# Altium project ADH_XC7Z010_SoC.PrjPcb (part 3 of 10)

## Sheet Zynq_Power.SchDoc: Zynq Power
size A3; DrawnBy: Emre Can Damyanlı; Revision: A.1; SheetNumber: 3; SheetTotal: 4; ENG_APP_DATE: --/--/--; DSN_APP_DATE: --/--/--; CHK_APP_DATE: --/--/--
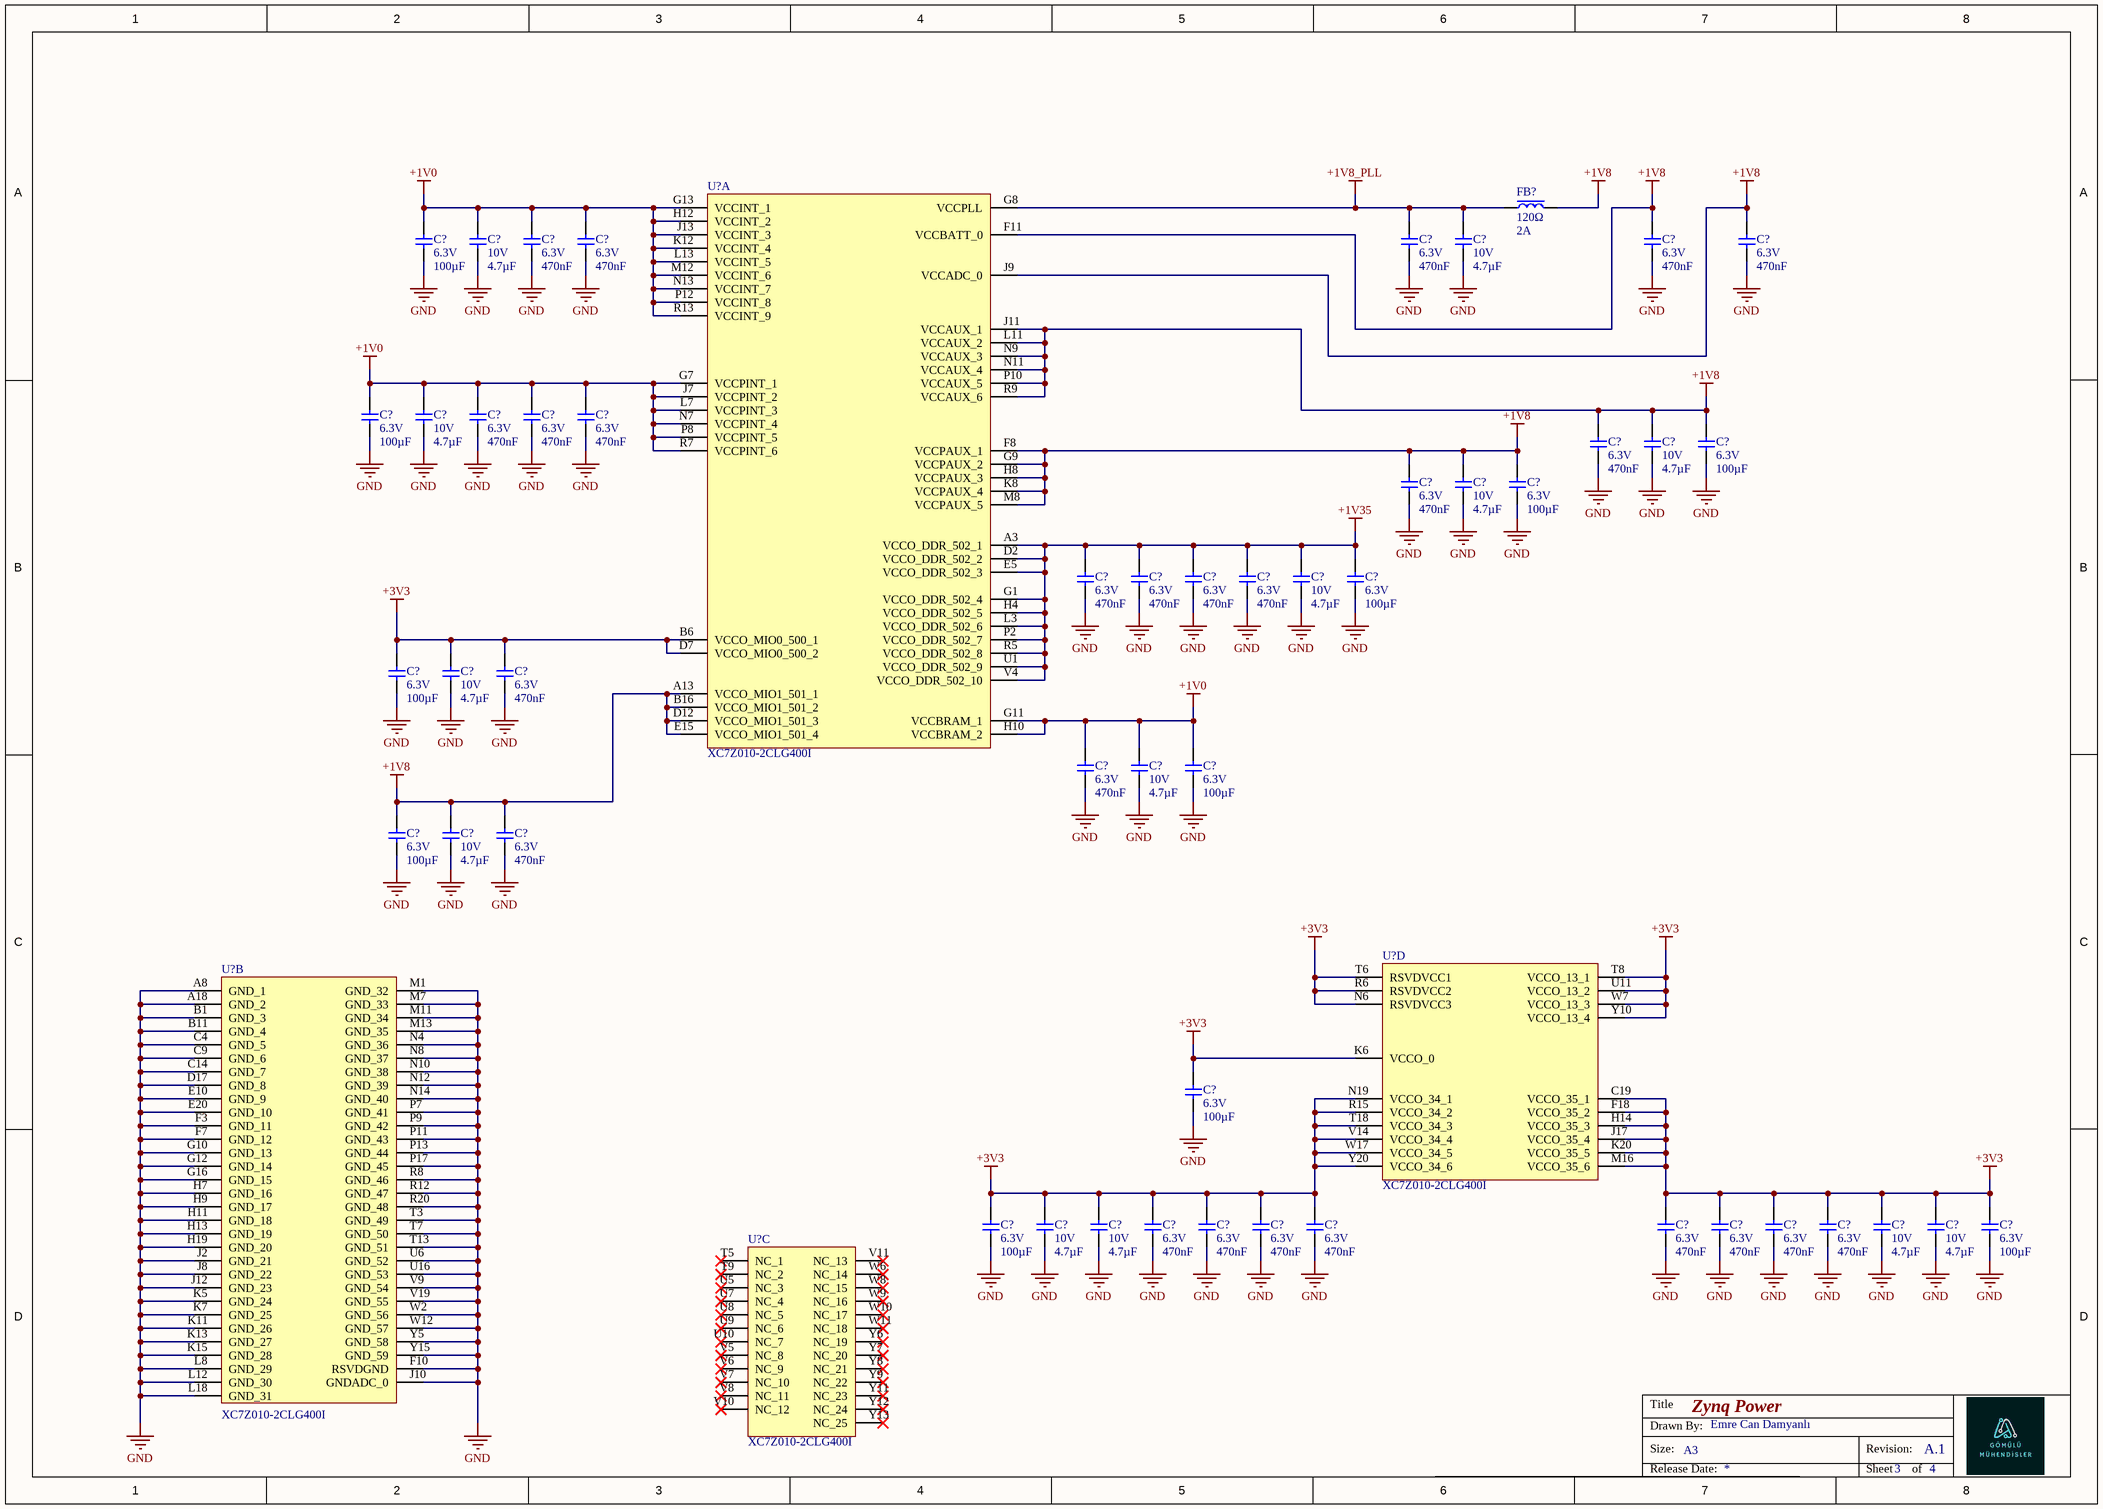
[diagram p2: Zynq_Power.SchDoc]

### Parts
(Parts that share a designator on the sheet are numbered #1, #2 ... from top to bottom, then left to right.)
C?#51  value 100µF  Voltage: 6.3V  [CAPC3225X140N]  (hidden comment: CL32A107MQVNNNE)
C?#52  value 4.7µF  Voltage Rating: 10V  [CAPC1005X55N]  (hidden comment: CL05A475MP5NRNC)
C?#53  value 470nF  Voltage Rating: 6.3V  [CAPC0603X33N]  (hidden comment: GRM033R60J474KE90D)
C?#54  value 470nF  Voltage Rating: 6.3V  [CAPC0603X33N]  (hidden comment: GRM033R60J474KE90D)
C?#55  value 470nF  Voltage Rating: 6.3V  [CAPC0603X33N]  (hidden comment: GRM033R60J474KE90D)
C?#56  value 4.7µF  Voltage Rating: 10V  [CAPC1005X55N]  (hidden comment: CL05A475MP5NRNC)
C?#57  value 470nF  Voltage Rating: 6.3V  [CAPC0603X33N]  (hidden comment: GRM033R60J474KE90D)
C?#58  value 470nF  Voltage Rating: 6.3V  [CAPC0603X33N]  (hidden comment: GRM033R60J474KE90D)
C?#59  value 100µF  Voltage: 6.3V  [CAPC3225X140N]  (hidden comment: CL32A107MQVNNNE)
C?#60  value 4.7µF  Voltage Rating: 10V  [CAPC1005X55N]  (hidden comment: CL05A475MP5NRNC)
C?#61  value 470nF  Voltage Rating: 6.3V  [CAPC0603X33N]  (hidden comment: GRM033R60J474KE90D)
C?#62  value 470nF  Voltage Rating: 6.3V  [CAPC0603X33N]  (hidden comment: GRM033R60J474KE90D)
C?#63  value 470nF  Voltage Rating: 6.3V  [CAPC0603X33N]  (hidden comment: GRM033R60J474KE90D)
C?#64  value 470nF  Voltage Rating: 6.3V  [CAPC0603X33N]  (hidden comment: GRM033R60J474KE90D)
C?#65  value 4.7µF  Voltage Rating: 10V  [CAPC1005X55N]  (hidden comment: CL05A475MP5NRNC)
C?#66  value 100µF  Voltage: 6.3V  [CAPC3225X140N]  (hidden comment: CL32A107MQVNNNE)
C?#67  value 470nF  Voltage Rating: 6.3V  [CAPC0603X33N]  (hidden comment: GRM033R60J474KE90D)
C?#68  value 4.7µF  Voltage Rating: 10V  [CAPC1005X55N]  (hidden comment: CL05A475MP5NRNC)
C?#69  value 100µF  Voltage: 6.3V  [CAPC3225X140N]  (hidden comment: CL32A107MQVNNNE)
C?#70  value 470nF  Voltage Rating: 6.3V  [CAPC0603X33N]  (hidden comment: GRM033R60J474KE90D)
C?#71  value 470nF  Voltage Rating: 6.3V  [CAPC0603X33N]  (hidden comment: GRM033R60J474KE90D)
C?#72  value 470nF  Voltage Rating: 6.3V  [CAPC0603X33N]  (hidden comment: GRM033R60J474KE90D)
C?#73  value 470nF  Voltage Rating: 6.3V  [CAPC0603X33N]  (hidden comment: GRM033R60J474KE90D)
C?#74  value 4.7µF  Voltage Rating: 10V  [CAPC1005X55N]  (hidden comment: CL05A475MP5NRNC)
C?#75  value 100µF  Voltage: 6.3V  [CAPC3225X140N]  (hidden comment: CL32A107MQVNNNE)
C?#76  value 100µF  Voltage: 6.3V  [CAPC3225X140N]  (hidden comment: CL32A107MQVNNNE)
C?#77  value 4.7µF  Voltage Rating: 10V  [CAPC1005X55N]  (hidden comment: CL05A475MP5NRNC)
C?#78  value 470nF  Voltage Rating: 6.3V  [CAPC0603X33N]  (hidden comment: GRM033R60J474KE90D)
C?#79  value 470nF  Voltage Rating: 6.3V  [CAPC0603X33N]  (hidden comment: GRM033R60J474KE90D)
C?#80  value 4.7µF  Voltage Rating: 10V  [CAPC1005X55N]  (hidden comment: CL05A475MP5NRNC)
C?#81  value 100µF  Voltage: 6.3V  [CAPC3225X140N]  (hidden comment: CL32A107MQVNNNE)
C?#82  value 100µF  Voltage: 6.3V  [CAPC3225X140N]  (hidden comment: CL32A107MQVNNNE)
C?#83  value 4.7µF  Voltage Rating: 10V  [CAPC1005X55N]  (hidden comment: CL05A475MP5NRNC)
C?#84  value 470nF  Voltage Rating: 6.3V  [CAPC0603X33N]  (hidden comment: GRM033R60J474KE90D)
C?#85  value 100µF  Voltage: 6.3V  [CAPC3225X140N]  (hidden comment: CL32A107MQVNNNE)
C?#86  value 100µF  Voltage: 6.3V  [CAPC3225X140N]  (hidden comment: CL32A107MQVNNNE)
C?#87  value 4.7µF  Voltage Rating: 10V  [CAPC1005X55N]  (hidden comment: CL05A475MP5NRNC)
C?#88  value 4.7µF  Voltage Rating: 10V  [CAPC1005X55N]  (hidden comment: CL05A475MP5NRNC)
C?#89  value 470nF  Voltage Rating: 6.3V  [CAPC0603X33N]  (hidden comment: GRM033R60J474KE90D)
C?#90  value 470nF  Voltage Rating: 6.3V  [CAPC0603X33N]  (hidden comment: GRM033R60J474KE90D)
C?#91  value 470nF  Voltage Rating: 6.3V  [CAPC0603X33N]  (hidden comment: GRM033R60J474KE90D)
C?#92  value 470nF  Voltage Rating: 6.3V  [CAPC0603X33N]  (hidden comment: GRM033R60J474KE90D)
C?#93  value 470nF  Voltage Rating: 6.3V  [CAPC0603X33N]  (hidden comment: GRM033R60J474KE90D)
C?#94  value 470nF  Voltage Rating: 6.3V  [CAPC0603X33N]  (hidden comment: GRM033R60J474KE90D)
C?#95  value 470nF  Voltage Rating: 6.3V  [CAPC0603X33N]  (hidden comment: GRM033R60J474KE90D)
C?#96  value 470nF  Voltage Rating: 6.3V  [CAPC0603X33N]  (hidden comment: GRM033R60J474KE90D)
C?#97  value 4.7µF  Voltage Rating: 10V  [CAPC1005X55N]  (hidden comment: CL05A475MP5NRNC)
C?#98  value 4.7µF  Voltage Rating: 10V  [CAPC1005X55N]  (hidden comment: CL05A475MP5NRNC)
C?#99  value 100µF  Voltage: 6.3V  [CAPC3225X140N]  (hidden comment: CL32A107MQVNNNE)
FB?#2  Impedance: 120Ω  Max Current Rating: 2A  [FERRITE_0402]  (hidden comment: BLM15PX121SN1D)
U?#7  XC7Z010-2CLG400I  [BGA400C80P20X20_1700X1700X160]  (part A of 9)
U?#8  XC7Z010-2CLG400I  [BGA400C80P20X20_1700X1700X160]  (part D of 9)
U?#9  XC7Z010-2CLG400I  [BGA400C80P20X20_1700X1700X160]  (part B of 9)
U?#10  XC7Z010-2CLG400I  [BGA400C80P20X20_1700X1700X160]  (part C of 9)

### Nets
+1V0: C?#51.2 C?#52.2 C?#53.2 C?#54.2 C?#59.2 C?#60.2 C?#61.2 C?#62.2 C?#63.2 C?#79.2 C?#80.2 C?#81.2 U?#7.G7(VCCPINT_1) U?#7.G11(VCCBRAM_1) U?#7.G13(VCCINT_1) U?#7.H10(VCCBRAM_2) U?#7.H12(VCCINT_2) U?#7.J7(VCCPINT_2) U?#7.J13(VCCINT_3) U?#7.K12(VCCINT_4) U?#7.L7(VCCPINT_3) U?#7.L13(VCCINT_5) U?#7.M12(VCCINT_6) U?#7.N7(VCCPINT_4) U?#7.N13(VCCINT_7) U?#7.P8(VCCPINT_5) U?#7.P12(VCCINT_8) U?#7.R7(VCCPINT_6) U?#7.R13(VCCINT_9)
+1V8: C?#57.2 C?#58.2 C?#64.2 C?#65.2 C?#66.2 C?#67.2 C?#68.2 C?#69.2 C?#82.2 C?#83.2 C?#84.2 FB?#2.2 U?#7.A13(VCCO_MIO1_501_1) U?#7.B16(VCCO_MIO1_501_2) U?#7.D12(VCCO_MIO1_501_3) U?#7.E15(VCCO_MIO1_501_4) U?#7.F8(VCCPAUX_1) U?#7.F11(VCCBATT_0) U?#7.G9(VCCPAUX_2) U?#7.H8(VCCPAUX_3) U?#7.J9(VCCADC_0) U?#7.J11(VCCAUX_1) U?#7.K8(VCCPAUX_4) U?#7.L11(VCCAUX_2) U?#7.M8(VCCPAUX_5) U?#7.N9(VCCAUX_3) U?#7.N11(VCCAUX_4) U?#7.P10(VCCAUX_5) U?#7.R9(VCCAUX_6)
+1V8_PLL: C?#55.2 C?#56.2 FB?#2.1 U?#7.G8(VCCPLL)
+1V35: C?#70.2 C?#71.2 C?#72.2 C?#73.2 C?#74.2 C?#75.2 U?#7.A3(VCCO_DDR_502_1) U?#7.D2(VCCO_DDR_502_2) U?#7.E5(VCCO_DDR_502_3) U?#7.G1(VCCO_DDR_502_4) U?#7.H4(VCCO_DDR_502_5) U?#7.L3(VCCO_DDR_502_6) U?#7.P2(VCCO_DDR_502_7) U?#7.R5(VCCO_DDR_502_8) U?#7.U1(VCCO_DDR_502_9) U?#7.V4(VCCO_DDR_502_10)
+3V3: C?#76.2 C?#77.2 C?#78.2 C?#85.2 C?#86.2 C?#87.2 C?#88.2 C?#89.2 C?#90.2 C?#91.2 C?#92.2 C?#93.2 C?#94.2 C?#95.2 C?#96.2 C?#97.2 C?#98.2 C?#99.2 U?#7.B6(VCCO_MIO0_500_1) U?#7.D7(VCCO_MIO0_500_2) U?#8.C19(VCCO_35_1) U?#8.F18(VCCO_35_2) U?#8.H14(VCCO_35_3) U?#8.J17(VCCO_35_4) U?#8.K6(VCCO_0) U?#8.K20(VCCO_35_5) U?#8.M16(VCCO_35_6) U?#8.N6(RSVDVCC3) U?#8.N19(VCCO_34_1) U?#8.R6(RSVDVCC2) U?#8.R15(VCCO_34_2) U?#8.T6(RSVDVCC1) U?#8.T8(VCCO_13_1) U?#8.T18(VCCO_34_3) U?#8.U11(VCCO_13_2) U?#8.V14(VCCO_34_4) U?#8.W7(VCCO_13_3) U?#8.W17(VCCO_34_5) U?#8.Y10(VCCO_13_4) U?#8.Y20(VCCO_34_6)
GND: C?#51.1 C?#52.1 C?#53.1 C?#54.1 C?#55.1 C?#56.1 C?#57.1 C?#58.1 C?#59.1 C?#60.1 C?#61.1 C?#62.1 C?#63.1 C?#64.1 C?#65.1 C?#66.1 C?#67.1 C?#68.1 C?#69.1 C?#70.1 C?#71.1 C?#72.1 C?#73.1 C?#74.1 C?#75.1 C?#76.1 C?#77.1 C?#78.1 C?#79.1 C?#80.1 C?#81.1 C?#82.1 C?#83.1 C?#84.1 C?#85.1 C?#86.1 C?#87.1 C?#88.1 C?#89.1 C?#90.1 C?#91.1 C?#92.1 C?#93.1 C?#94.1 C?#95.1 C?#96.1 C?#97.1 C?#98.1 C?#99.1 U?#9.A8(GND_1) U?#9.A18(GND_2) U?#9.B1(GND_3) U?#9.B11(GND_4) U?#9.C4(GND_5) U?#9.C9(GND_6) U?#9.C14(GND_7) U?#9.D17(GND_8) U?#9.E10(GND_9) U?#9.E20(GND_10) U?#9.F3(GND_11) U?#9.F7(GND_12) U?#9.F10(RSVDGND) U?#9.G10(GND_13) U?#9.G12(GND_14) U?#9.G16(GND_15) U?#9.H7(GND_16) U?#9.H9(GND_17) U?#9.H11(GND_18) U?#9.H13(GND_19) U?#9.H19(GND_20) U?#9.J2(GND_21) U?#9.J8(GND_22) U?#9.J10(GNDADC_0) U?#9.J12(GND_23) U?#9.K5(GND_24) U?#9.K7(GND_25) U?#9.K11(GND_26) U?#9.K13(GND_27) U?#9.K15(GND_28) U?#9.L8(GND_29) U?#9.L12(GND_30) U?#9.L18(GND_31) U?#9.M1(GND_32) U?#9.M7(GND_33) U?#9.M11(GND_34) U?#9.M13(GND_35) U?#9.N4(GND_36) U?#9.N8(GND_37) U?#9.N10(GND_38) U?#9.N12(GND_39) U?#9.N14(GND_40) U?#9.P7(GND_41) U?#9.P9(GND_42) U?#9.P11(GND_43) U?#9.P13(GND_44) U?#9.P17(GND_45) U?#9.R8(GND_46) U?#9.R12(GND_47) U?#9.R20(GND_48) U?#9.T3(GND_49) U?#9.T7(GND_50) U?#9.T13(GND_51) U?#9.U6(GND_52) U?#9.U16(GND_53) U?#9.V9(GND_54) U?#9.V19(GND_55) U?#9.W2(GND_56) U?#9.W12(GND_57) U?#9.Y5(GND_58) U?#9.Y15(GND_59)

Not connected (* = marked no-connect by the designer): U?#10 T5(NC_1)* T9(NC_2)* U5(NC_3)* U7(NC_4)* U8(NC_5)* U9(NC_6)* U10(NC_7)* V5(NC_8)* V6(NC_9)* V7(NC_10)* V8(NC_11)* V10(NC_12)* V11(NC_13)* W6(NC_14)* W8(NC_15)* W9(NC_16)* W10(NC_17)* W11(NC_18)* Y6(NC_19)* Y7(NC_20)* Y8(NC_21)* Y9(NC_22)* Y11(NC_23)* Y12(NC_24)* Y13(NC_25)*

### Notes on the sheet
- Title
- Size:
- Drawn By:
- A3
- Revision:
- Release Date:
- Sheet
- of

### Library data of the parts
C?#51 C?#59 C?#66 C?#69 C?#75 C?#76 C?#81 C?#82 C?#85 C?#86 C?#99 = CL32A107MQVNNNE: 6.3V 100uF X5R ±20% 1210 Multilayer Ceramic Capacitors MLCC - SMD/SMT ROHS; Manufacturer: Samsung Electro-Mechanics; Supplier: Avnet; Supplier Part Number: 82AC9521; Manufacturer Part Number: CL32A107MQVNNNE; RoHS: Compliant; Category: Ceramic Capacitors; Stock: 76691; Pricing: 1=0,707, 10=0,427, 25=0,371, 50=0,315, 100=0,28 (USD); Case/Package: 1210; Case Code (Imperial): 1210; Case Code (Metric): 3225; China RoHS: Compliant; Contact Plating: Tin; Depth: 2.5mm; Dielectric: X5R; Dielectric Material: Ceramic; Height: 2.8mm; Lead Free: Lead Free; Length: 3.2mm; Lifecycle Status: Production; Material: Ceramic; Max Operating Temperature: 85°C; Min Operating Temperature: -55°C; Mounting Technology: Surface Mount; Number of Terminals: 2; Radiation Hardening: No; REACH SVHC: Yes; Schedule B: 8532240020, 8532240020|8532240020|8532240020|8532240020|8532240020|8532240020|8532240020|8532240020|8532240020|8532240020|8532240020|8532240020|8532240020|8532240020|8532240020|8532240020|8532240020|8532240020|8532240020|8532240020|8532240020|8532240020|8532240020|85; Thickness: 2.794mm; Tolerance: 20%; Voltage Rating: 6.3V; Voltage Rating (DC): 6.3V; Width: 2.5mm; ComponentLink1URL: https://datasheet.octopart.com:443/CL32A107MQVNNNE-Samsung-Electro-Mechanics-datasheet-181552186.pdf?src-supplier=Farnell; ComponentLink1Description: https://datasheet.octopart.com:443/CL32A107MQVNNNE-Samsung-Electro-Mechanics-datasheet-181552186.pdf?src-supplier=Farnell; ComponentLink2URL: https://datasheet.octopart.com:443/CL32A107MQVNNNE-Samsung-Electro-Mechanics-datasheet-136031867.pdf?src-supplier=Samsung+SCT; ComponentLink2Description: https://datasheet.octopart.com:443/CL32A107MQVNNNE-Samsung-Electro-Mechanics-datasheet-136031867.pdf?src-supplier=Samsung+SCT; ComponentLink3URL: https://datasheet.octopart.com:443/CL32A107MQVNNNE-Samsung-Electro-Mechanics-datasheet-11731531.pdf?src-supplier=Future+Electronics; ComponentLink3Description: https://datasheet.octopart.com:443/CL32A107MQVNNNE-Samsung-Electro-Mechanics-datasheet-11731531.pdf?src-supplier=Future+Electronics; ComponentLink4URL: https://datasheet.octopart.com:443/CL32A107MQVNNNE-Samsung-Electro-Mechanics-datasheet-149048019.pdf?src-supplier=Future+Electronics; ComponentLink4Description: https://datasheet.octopart.com:443/CL32A107MQVNNNE-Samsung-Electro-Mechanics-datasheet-149048019.pdf?src-supplier=Future+Electronics; ComponentLink5URL: https://datasheet.octopart.com:443/CL32A107MQVNNNE-Samsung-Electro-Mechanics-datasheet-110334290.pdf?src-supplier=Future+Electronics; ComponentLink5Description: https://datasheet.octopart.com:443/CL32A107MQVNNNE-Samsung-Electro-Mechanics-datasheet-110334290.pdf?src-supplier=Future+Electronics; ComponentLink6URL: https://datasheet.octopart.com:443/CL32A107MQVNNNE-Samsung-Electro-Mechanics-datasheet-81462611.pdf?src-supplier=Future+Electronics; ComponentLink6Description: https://datasheet.octopart.com:443/CL32A107MQVNNNE-Samsung-Electro-Mechanics-datasheet-81462611.pdf?src-supplier=Future+Electronics; ComponentLink7URL: https://datasheet.octopart.com:443/CL32A107MQVNNNE-Samsung-datasheet-48757337.pdf?src-supplier=Future+Electronics; ComponentLink7Description: https://datasheet.octopart.com:443/CL32A107MQVNNNE-Samsung-datasheet-48757337.pdf?src-supplier=Future+Electronics; ComponentLink8URL: https://datasheet.octopart.com:443/CL32A107MQVNNNE-Samsung-datasheet-34175070.pdf?src-supplier=Future+Electronics; ComponentLink8Description: https://datasheet.octopart.com:443/CL32A107MQVNNNE-Samsung-datasheet-34175070.pdf?src-supplier=Future+Electronics; ComponentLink9URL: https://datasheet.octopart.com/CL32A107MQVNNNE-Samsung-Electro-Mechanics-datasheet-8324245.pdf; ComponentLink9Description: https://datasheet.octopart.com/CL32A107MQVNNNE-Samsung-Electro-Mechanics-datasheet-8324245.pdf; ComponentLink10URL: https://datasheet.octopart.com/CL32A107MQVNNNE-Samsung-Electro-Mechanics-datasheet-97040617.pdf; ComponentLink10Description: https://datasheet.octopart.com/CL32A107MQVNNNE-Samsung-Electro-Mechanics-datasheet-97040617.pdf; ComponentLink11URL: https://datasheet.octopart.com/General-Multilayer-Ceramic-Capacitors-Samsung-datasheet-family-111.pdf; ComponentLink11Description: https://datasheet.octopart.com/General-Multilayer-Ceramic-Capacitors-Samsung-datasheet-family-111.pdf; ComponentLink12URL: https://datasheet.octopart.com:443/CL32A107MQVNNNE-Samsung-datasheet-151956601.pdf?src-supplier=SOS+electronic; ComponentLink12Description: https://datasheet.octopart.com:443/CL32A107MQVNNNE-Samsung-datasheet-151956601.pdf?src-supplier=SOS+electronic; ComponentLink13URL: https://datasheet.octopart.com:443/CL32A107MQVNNNE-Samsung-datasheet-151956603.pdf?src-supplier=SOS+electronic; ComponentLink13Description: https://datasheet.octopart.com:443/CL32A107MQVNNNE-Samsung-datasheet-151956603.pdf?src-supplier=SOS+electronic; ComponentLink14URL: https://datasheet.octopart.com:443/CL32A107MQVNNNE-Samsung-datasheet-8326407.pdf?src-supplier=TME; ComponentLink14Description: https://datasheet.octopart.com:443/CL32A107MQVNNNE-Samsung-datasheet-8326407.pdf?src-supplier=TME; ComponentLink15URL: http://sigma.octopart.com:80/rohs_certificate/General-Multilayer-Ceramic-Capacitors-Samsung-family-110.pdf?src-supplier=Compliance+Statements; ComponentLink15Description: http://sigma.octopart.com:80/rohs_certificate/General-Multilayer-Ceramic-Capacitors-Samsung-family-110.pdf?src-supplier=Compliance+Statements; ComponentLink16URL: http://sigma.octopart.com:80/rohs_statement/General-Multilayer-Ceramic-Capacitors-Samsung-family-132.pdf?src-supplier=Compliance+Statements; ComponentLink16Description: http://sigma.octopart.com:80/rohs_statement/General-Multilayer-Ceramic-Capacitors-Samsung-family-132.pdf?src-supplier=Compliance+Statements; ComponentLink17URL: http://sigma.octopart.com:80/reach_statement/General-Multilayer-Ceramic-Capacitors-Samsung-family-133.pdf?src-supplier=Compliance+Statements; ComponentLink17Description: http://sigma.octopart.com:80/reach_statement/General-Multilayer-Ceramic-Capacitors-Samsung-family-133.pdf?src-supplier=Compliance+Statements
C?#52 C?#56 C?#60 C?#65 C?#68 C?#74 C?#77 C?#80 C?#83 C?#87 C?#88 C?#97 C?#98 = CL05A475MP5NRNC: Ceramic Capacitor, Multilayer, Ceramic, 10V, 20% +Tol, 20% -Tol, X5R, +-15% TC, 4.7uF, Surface Mount, 0402 inch; Manufacturer: Samsung Electro-Mechanics; Supplier: Avnet; Supplier Part Number: CL05A475MP5NRNC; Manufacturer Part Number: CL05A475MP5NRNC; RoHS: Compliant; Category: Ceramic Capacitors; Stock: 40000; Pricing: 10000=0,00671, 20000=0,00663, 40000=0,0066, 80000=0,00656, 160000=0,00653 (USD); Case/Package: 0402; Case Code (Imperial): 0402; Case Code (Metric): 1005; China RoHS: Compliant; Dielectric: X5R; Dielectric Material: Ceramic; Height: 500µm; Lead Free: Lead Free; Length: 1mm; Lifecycle Status: Production; Material: Ceramic; Max Operating Temperature: 85°C; Min Operating Temperature: -55°C; Mounting Technology: Surface Mount; Number of Terminals: 2; REACH SVHC: Yes; Schedule B: 8532240020, 8532240020|8532240020|8532240020|8532240020|8532240020|8532240020|8532240020|8532240020|8532240020|8532240020|8532240020|8532240020|8532240020|8532240020|8532240020|8532240020|8532240020|8532240020|8532240020|8532240020|8532240020|8532240020, 8532240020|8532240020|8532240020|8532240020|8532240020|8532240020|8532240020|8532240020|8532240020|8532240020|8532240020|8532240020|8532240020|8532240020|8532240020|8532240020|8532240020|8532240020|8532240020|8532240020|8532240020|8532240020|8532240020, 8532240020|8532240020|8532240020|8532240020|8532240020|8532240020|8532240020|8532240020|8532240020|8532240020|8532240020|8532240020|8532240020|8532240020|8532240020|8532240020|8532240020|8532240020|8532240020|8532240020|8532240020|8532240020|8532240020|85; Thickness: 558.8µm; Tolerance: 20%; Voltage Rating (DC): 10V; Width: 500µm; ComponentLink1URL: https://datasheet.octopart.com:443/CL05A475MP5NRNC-Samsung-Electro-Mechanics-datasheet-181551186.pdf?src-supplier=Newark; ComponentLink1Description: https://datasheet.octopart.com:443/CL05A475MP5NRNC-Samsung-Electro-Mechanics-datasheet-181551186.pdf?src-supplier=Newark; ComponentLink2URL: https://datasheet.octopart.com:443/CL05A475MP5NRNC-Samsung-Electro-Mechanics-datasheet-136482298.pdf?src-supplier=Newark; ComponentLink2Description: https://datasheet.octopart.com:443/CL05A475MP5NRNC-Samsung-Electro-Mechanics-datasheet-136482298.pdf?src-supplier=Newark; ComponentLink3URL: https://datasheet.octopart.com:443/CL05A475MP5NRNC-Samsung-Electro-Mechanics-datasheet-136031736.pdf?src-supplier=Future+Electronics; ComponentLink3Description: https://datasheet.octopart.com:443/CL05A475MP5NRNC-Samsung-Electro-Mechanics-datasheet-136031736.pdf?src-supplier=Future+Electronics; ComponentLink4URL: https://datasheet.octopart.com:443/CL05A475MP5NRNC-Samsung-Electro-Mechanics-datasheet-110226226.pdf?src-supplier=Future+Electronics; ComponentLink4Description: https://datasheet.octopart.com:443/CL05A475MP5NRNC-Samsung-Electro-Mechanics-datasheet-110226226.pdf?src-supplier=Future+Electronics; ComponentLink5URL: https://datasheet.octopart.com:443/CL05A475MP5NRNC-Samsung-Electro-Mechanics-datasheet-87580058.pdf?src-supplier=Future+Electronics; ComponentLink5Description: https://datasheet.octopart.com:443/CL05A475MP5NRNC-Samsung-Electro-Mechanics-datasheet-87580058.pdf?src-supplier=Future+Electronics; ComponentLink6URL: https://datasheet.octopart.com:443/CL05A475MP5NRNC-Samsung-Electro-Mechanics-datasheet-81461611.pdf?src-supplier=Future+Electronics; ComponentLink6Description: https://datasheet.octopart.com:443/CL05A475MP5NRNC-Samsung-Electro-Mechanics-datasheet-81461611.pdf?src-supplier=Future+Electronics; ComponentLink7URL: https://datasheet.octopart.com:443/CL05A475MP5NRNC-Samsung-datasheet-48647200.pdf?src-supplier=Future+Electronics; ComponentLink7Description: https://datasheet.octopart.com:443/CL05A475MP5NRNC-Samsung-datasheet-48647200.pdf?src-supplier=Future+Electronics; ComponentLink8URL: https://datasheet.octopart.com:443/CL05A475MP5NRNC-Samsung-datasheet-34153549.pdf?src-supplier=Future+Electronics; ComponentLink8Description: https://datasheet.octopart.com:443/CL05A475MP5NRNC-Samsung-datasheet-34153549.pdf?src-supplier=Future+Electronics; ComponentLink9URL: https://datasheet.octopart.com:443/CL05A475MP5NRNC-Samsung-datasheet-26589015.pdf?src-supplier=Future+Electronics; ComponentLink9Description: https://datasheet.octopart.com:443/CL05A475MP5NRNC-Samsung-datasheet-26589015.pdf?src-supplier=Future+Electronics; ComponentLink10URL: https://datasheet.octopart.com:443/CL05A475MP5NRNC-Samsung-datasheet-8324245.pdf?src-supplier=Future+Electronics; ComponentLink10Description: https://datasheet.octopart.com:443/CL05A475MP5NRNC-Samsung-datasheet-8324245.pdf?src-supplier=Future+Electronics; ComponentLink11URL: https://datasheet.octopart.com:443/CL05A475MP5NRNC-Samsung-Electro-Mechanics-datasheet-149136695.pdf?src-supplier=Future+Electronics; ComponentLink11Description: https://datasheet.octopart.com:443/CL05A475MP5NRNC-Samsung-Electro-Mechanics-datasheet-149136695.pdf?src-supplier=Future+Electronics; ComponentLink12URL: https://datasheet.octopart.com:443/CL05A475MP5NRNC-Samsung-datasheet-8326407.pdf?src-supplier=TME; ComponentLink12Description: https://datasheet.octopart.com:443/CL05A475MP5NRNC-Samsung-datasheet-8326407.pdf?src-supplier=TME
C?#53-C?#55 C?#57 C?#58 C?#61-C?#64 C?#67 C?#70-C?#73 C?#78 C?#79 C?#84 C?#89-C?#96 = GRM033R60J474KE90D: Ceramic Capacitor, Ceramic, 6.3V, 10% +Tol, 10% -Tol, X5R, 15% TC, 0.47uF, Surface Mount, 0201; Manufacturer: Murata; Manufacturer Lifecycle Status: IN PRODUCTION; Supplier: Arrow Electronics; Supplier Part Number: GRM033R60J474KE90D; Manufacturer Part Number: GRM033R60J474KE90D; RoHS: Compliant; Category: Ceramic Capacitors; Stock: 1170000; Pricing: 15000=0,004 (USD); Case/Package: 0201; Case Code (Imperial): 0201; Case Code (Metric): 0603; Depth: 300µm; Dielectric: X5R; Dielectric Material: Ceramic; Height: 300µm; Lead Free: Lead Free; Length: 600µm; Lifecycle Status: Production; Material: Ceramic; Max Operating Temperature: 85°C; Min Operating Temperature: -55°C; Mounting Technology: Surface Mount; Number of Terminals: 2; Packaging: Tape & Reel (TR); REACH SVHC: Yes; Schedule B: 8532240020, 8532240020|8532240020, 8532240020|8532240020|8532240020, 8532240020|8532240020|8532240020|8532240020; Termination: SMD/SMT; Thickness: 300µm; Tolerance: 10%; Voltage Rating (DC): 6.3V; Weight: 340.194278µg; Width: 300µm; ComponentLink1URL: https://datasheet.octopart.com:443/GRM033R60J474KE90D-Murata-datasheet-165579666.pdf?src-supplier=TME; ComponentLink1Description: https://datasheet.octopart.com:443/GRM033R60J474KE90D-Murata-datasheet-165579666.pdf?src-supplier=TME; ComponentLink2URL: https://datasheet.octopart.com:443/GRM033R60J474KE90D-Murata-datasheet-141274201.pdf?src-supplier=Ciiva; ComponentLink2Description: https://datasheet.octopart.com:443/GRM033R60J474KE90D-Murata-datasheet-141274201.pdf?src-supplier=Ciiva; ComponentLink3URL: https://datasheet.octopart.com:443/GRM033R60J474KE90D-Murata-datasheet-140676048.pdf?src-supplier=Ciiva; ComponentLink3Description: https://datasheet.octopart.com:443/GRM033R60J474KE90D-Murata-datasheet-140676048.pdf?src-supplier=Ciiva; ComponentLink4URL: https://datasheet.octopart.com:443/GRM033R60J474KE90D-Murata-datasheet-138738366.pdf?src-supplier=Ciiva; ComponentLink4Description: https://datasheet.octopart.com:443/GRM033R60J474KE90D-Murata-datasheet-138738366.pdf?src-supplier=Ciiva; ComponentLink5URL: https://datasheet.octopart.com:443/GRM033R60J474KE90D-Murata-datasheet-22122223.pdf?src-supplier=Future+Electronics; ComponentLink5Description: https://datasheet.octopart.com:443/GRM033R60J474KE90D-Murata-datasheet-22122223.pdf?src-supplier=Future+Electronics; ComponentLink6URL: https://datasheet.octopart.com/GRM033R60J474KE90D-Murata-datasheet-12515295.pdf; ComponentLink6Description: https://datasheet.octopart.com/GRM033R60J474KE90D-Murata-datasheet-12515295.pdf; ComponentLink7URL: https://datasheet.octopart.com/GRM033R60J474KE90D-Murata-datasheet-12510076.pdf; ComponentLink7Description: https://datasheet.octopart.com/GRM033R60J474KE90D-Murata-datasheet-12510076.pdf; ComponentLink8URL: https://datasheet.octopart.com/GRM033R60J474KE90D-Murata-datasheet-11978611.pdf; ComponentLink8Description: https://datasheet.octopart.com/GRM033R60J474KE90D-Murata-datasheet-11978611.pdf; ComponentLink9URL: https://datasheet.octopart.com/GRM033R60J474KE90D-Murata-datasheet-10025737.pdf; ComponentLink9Description: https://datasheet.octopart.com/GRM033R60J474KE90D-Murata-datasheet-10025737.pdf; ComponentLink10URL: https://datasheet.octopart.com/GRM033R60J474KE90D-Murata-datasheet-8819587.pdf; ComponentLink10Description: https://datasheet.octopart.com/GRM033R60J474KE90D-Murata-datasheet-8819587.pdf; ComponentLink11URL: https://datasheet.octopart.com/GRM033R60J474KE90D-Murata-datasheet-17503195.pdf; ComponentLink11Description: https://datasheet.octopart.com/GRM033R60J474KE90D-Murata-datasheet-17503195.pdf; ComponentLink12URL: https://datasheet.octopart.com:443/GRM033R60J474KE90D-Murata-datasheet-150839311.pdf?src-supplier=Arrow.cn; ComponentLink12Description: https://datasheet.octopart.com:443/GRM033R60J474KE90D-Murata-datasheet-150839311.pdf?src-supplier=Arrow.cn; ComponentLink13URL: http://sigma.octopart.com:80/reach_statement/Murata-company-16.pdf?src-supplier=Compliance+Statements; ComponentLink13Description: http://sigma.octopart.com:80/reach_statement/Murata-company-16.pdf?src-supplier=Compliance+Statements
FB?#2 = BLM15PX121SN1D: Ferrite Beads Multi-Layer 120Ohm 25% 100MHz 2A 0.055Ohm DCR 0402 T/R; Manufacturer: Murata; Current Rating: 1.1A; DC Resistance (DCR): 55mΩ; Material: Steel; Number of Circuits: 1; Supplier: Arrow Electronics; Supplier Part Number: BLM15PX121SN1D; Manufacturer Part Number: BLM15PX121SN1D; RoHS: Compliant; Category: Ferrite Beads and Chips; Stock: 81241; Pricing: 4237=0,0236, 6000=0,023, 15000=0,023, 30000=0,022, 75000=0,022 (USD); Case/Package: 0402; Case Code (Imperial): 0402; Case Code (Metric): 1005; Contact Plating: Tin; Core Material: Ferrite; Height: 500µm; Lead Free: Lead Free; Length: 1mm; Lifecycle Status: Production; Max DC Current: 2A; Max Operating Temperature: 125°C; Min Operating Temperature: -55°C; Number of Lines: 1; Pins: 2; Number of Terminals: 2; Packaging: Tape and Reel; REACH SVHC: Yes; RMS Current (Irms): 2A; Schedule B: 8504500000, 8504500000|8504500000, 8504500000|8504500000|8504500000, 8504500000|8504500000|8504500000|8504500000; ESR: 55mΩ; Termination: SMD/SMT; Test Frequency: 100MHz; Tolerance: 25%; Weight: 652.039032µg; Width: 500µm; ComponentLink1URL: https://datasheet.octopart.com:443/BLM15PX121SN1D-Murata-datasheet-180806543.pdf?src-supplier=IHS; ComponentLink1Description: https://datasheet.octopart.com:443/BLM15PX121SN1D-Murata-datasheet-180806543.pdf?src-supplier=IHS; ComponentLink2URL: https://datasheet.octopart.com:443/BLM15PX121SN1D-Murata-datasheet-12522583.pdf?src-supplier=Upverter; ComponentLink2Description: https://datasheet.octopart.com:443/BLM15PX121SN1D-Murata-datasheet-12522583.pdf?src-supplier=Upverter; ComponentLink3URL: https://datasheet.octopart.com:443/BLM15PX121SN1D-Murata-datasheet-10083551.pdf?src-supplier=Upverter; ComponentLink3Description: https://datasheet.octopart.com:443/BLM15PX121SN1D-Murata-datasheet-10083551.pdf?src-supplier=Upverter; ComponentLink4URL: https://datasheet.octopart.com:443/BLM15PX121SN1D-Murata-datasheet-8508678.pdf?src-supplier=Upverter; ComponentLink4Description: https://datasheet.octopart.com:443/BLM15PX121SN1D-Murata-datasheet-8508678.pdf?src-supplier=Upverter; ComponentLink5URL: https://datasheet.octopart.com:443/BLM15PX121SN1D-Murata-datasheet-39128427.pdf?src-supplier=Newark; ComponentLink5Description: https://datasheet.octopart.com:443/BLM15PX121SN1D-Murata-datasheet-39128427.pdf?src-supplier=Newark; ComponentLink6URL: https://datasheet.octopart.com:443/BLM15PX121SN1D-Murata-datasheet-166171473.pdf?src-supplier=TME; ComponentLink6Description: https://datasheet.octopart.com:443/BLM15PX121SN1D-Murata-datasheet-166171473.pdf?src-supplier=TME; ComponentLink7URL: https://datasheet.octopart.com:443/BLM15PX121SN1D-Murata-datasheet-141257890.pdf?src-supplier=Ciiva; ComponentLink7Description: https://datasheet.octopart.com:443/BLM15PX121SN1D-Murata-datasheet-141257890.pdf?src-supplier=Ciiva; ComponentLink8URL: https://datasheet.octopart.com:443/BLM15PX121SN1D-Murata-datasheet-138706708.pdf?src-supplier=Ciiva; ComponentLink8Description: https://datasheet.octopart.com:443/BLM15PX121SN1D-Murata-datasheet-138706708.pdf?src-supplier=Ciiva; ComponentLink9URL: https://datasheet.octopart.com:443/BLM15PX121SN1D-Murata-datasheet-78375072.pdf?src-supplier=Future+Electronics; ComponentLink9Description: https://datasheet.octopart.com:443/BLM15PX121SN1D-Murata-datasheet-78375072.pdf?src-supplier=Future+Electronics; ComponentLink10URL: https://datasheet.octopart.com:443/BLM15PX121SN1D-Murata-datasheet-13563506.pdf?src-supplier=Future+Electronics; ComponentLink10Description: https://datasheet.octopart.com:443/BLM15PX121SN1D-Murata-datasheet-13563506.pdf?src-supplier=Future+Electronics; ComponentLink11URL: https://datasheet.octopart.com:443/BLM15PX121SN1D-Murata-datasheet-12545319.pdf?src-supplier=Future+Electronics; ComponentLink11Description: https://datasheet.octopart.com:443/BLM15PX121SN1D-Murata-datasheet-12545319.pdf?src-supplier=Future+Electronics; ComponentLink12URL: https://datasheet.octopart.com/BLM15PX121SN1D-Murata-datasheet-37129980.pdf; ComponentLink12Description: https://datasheet.octopart.com/BLM15PX121SN1D-Murata-datasheet-37129980.pdf; ComponentLink13URL: http://sigma.octopart.com:80/reach_statement/Murata-company-16.pdf?src-supplier=Compliance+Statements; ComponentLink13Description: http://sigma.octopart.com:80/reach_statement/Murata-company-16.pdf?src-supplier=Compliance+Statements
U?#7-U?#10 = XC7Z010-2CLG400I: MPU Zynq-7000 Thumb-2 32-Bit 733MHz 1.2V/3.3V 400-Pin CS-BGA; Manufacturer: AMD; Core Architecture: ARM; Data Bus Width: 32b; Frequency: 766MHz; Interface: CAN, EBI/EMI, Ethernet, I2C, MMC, SD, SDIO, SPI, UART, USART, USB; Max Supply Voltage: 1.05V; Min Supply Voltage: 950mV; Number of I/Os: 130; Operating Supply Voltage: 1V; Peripherals: DMA; Speed Grade: -2; Supplier: Farnell; Supplier Part Number: 2831085; Manufacturer Part Number: XC7Z010-2CLG400I; RoHS: Compliant; Category: System on Chip (SoC); Stock: 89; Pricing: 1=78,2 (EUR); Case/Package: BGA; China RoHS: Compliant; Contact Plating: Copper, Silver, Tin; Height - Seated (Max): 1.6mm; Length: 17mm; Lifecycle Status: Production; Clock Frequency: 733MHz; Max Operating Temperature: 100°C; Min Operating Temperature: -40°C; Pins: 400; Number of Terminals: 400; Radiation Hardening: No; REACH SVHC: Yes; Terminal Pitch: 800µm; Width: 17mm; ComponentLink1URL: https://datasheet.octopart.com:443/XC7Z010-2CLG400I-AMD-datasheet-159618399.pdf?src-supplier=IHS; ComponentLink1Description: https://datasheet.octopart.com:443/XC7Z010-2CLG400I-AMD-datasheet-159618399.pdf?src-supplier=IHS; ComponentLink2URL: https://datasheet.octopart.com:443/XC7Z010-2CLG400I-Xilinx-datasheet-134531205.pdf?src-supplier=Upverter; ComponentLink2Description: https://datasheet.octopart.com:443/XC7Z010-2CLG400I-Xilinx-datasheet-134531205.pdf?src-supplier=Upverter; ComponentLink3URL: https://datasheet.octopart.com:443/XC7Z010-2CLG400I-AMD-datasheet-101617038.pdf?src-supplier=Farnell; ComponentLink3Description: https://datasheet.octopart.com:443/XC7Z010-2CLG400I-AMD-datasheet-101617038.pdf?src-supplier=Farnell; ComponentLink4URL: https://datasheet.octopart.com:443/XC7Z010-2CLG400I-Xilinx-datasheet-159009919.pdf?src-supplier=Augswan; ComponentLink4Description: https://datasheet.octopart.com:443/XC7Z010-2CLG400I-Xilinx-datasheet-159009919.pdf?src-supplier=Augswan

## Sheet Zynq_JTAG_Programmer.SchDoc: Zynq JTAG Programmer
size A3; DrawnBy: Emre Can Damyanlı; Revision: A.1; SheetNumber: 4; SheetTotal: 4; ENG_APP_DATE: --/--/--; DSN_APP_DATE: --/--/--; CHK_APP_DATE: --/--/--
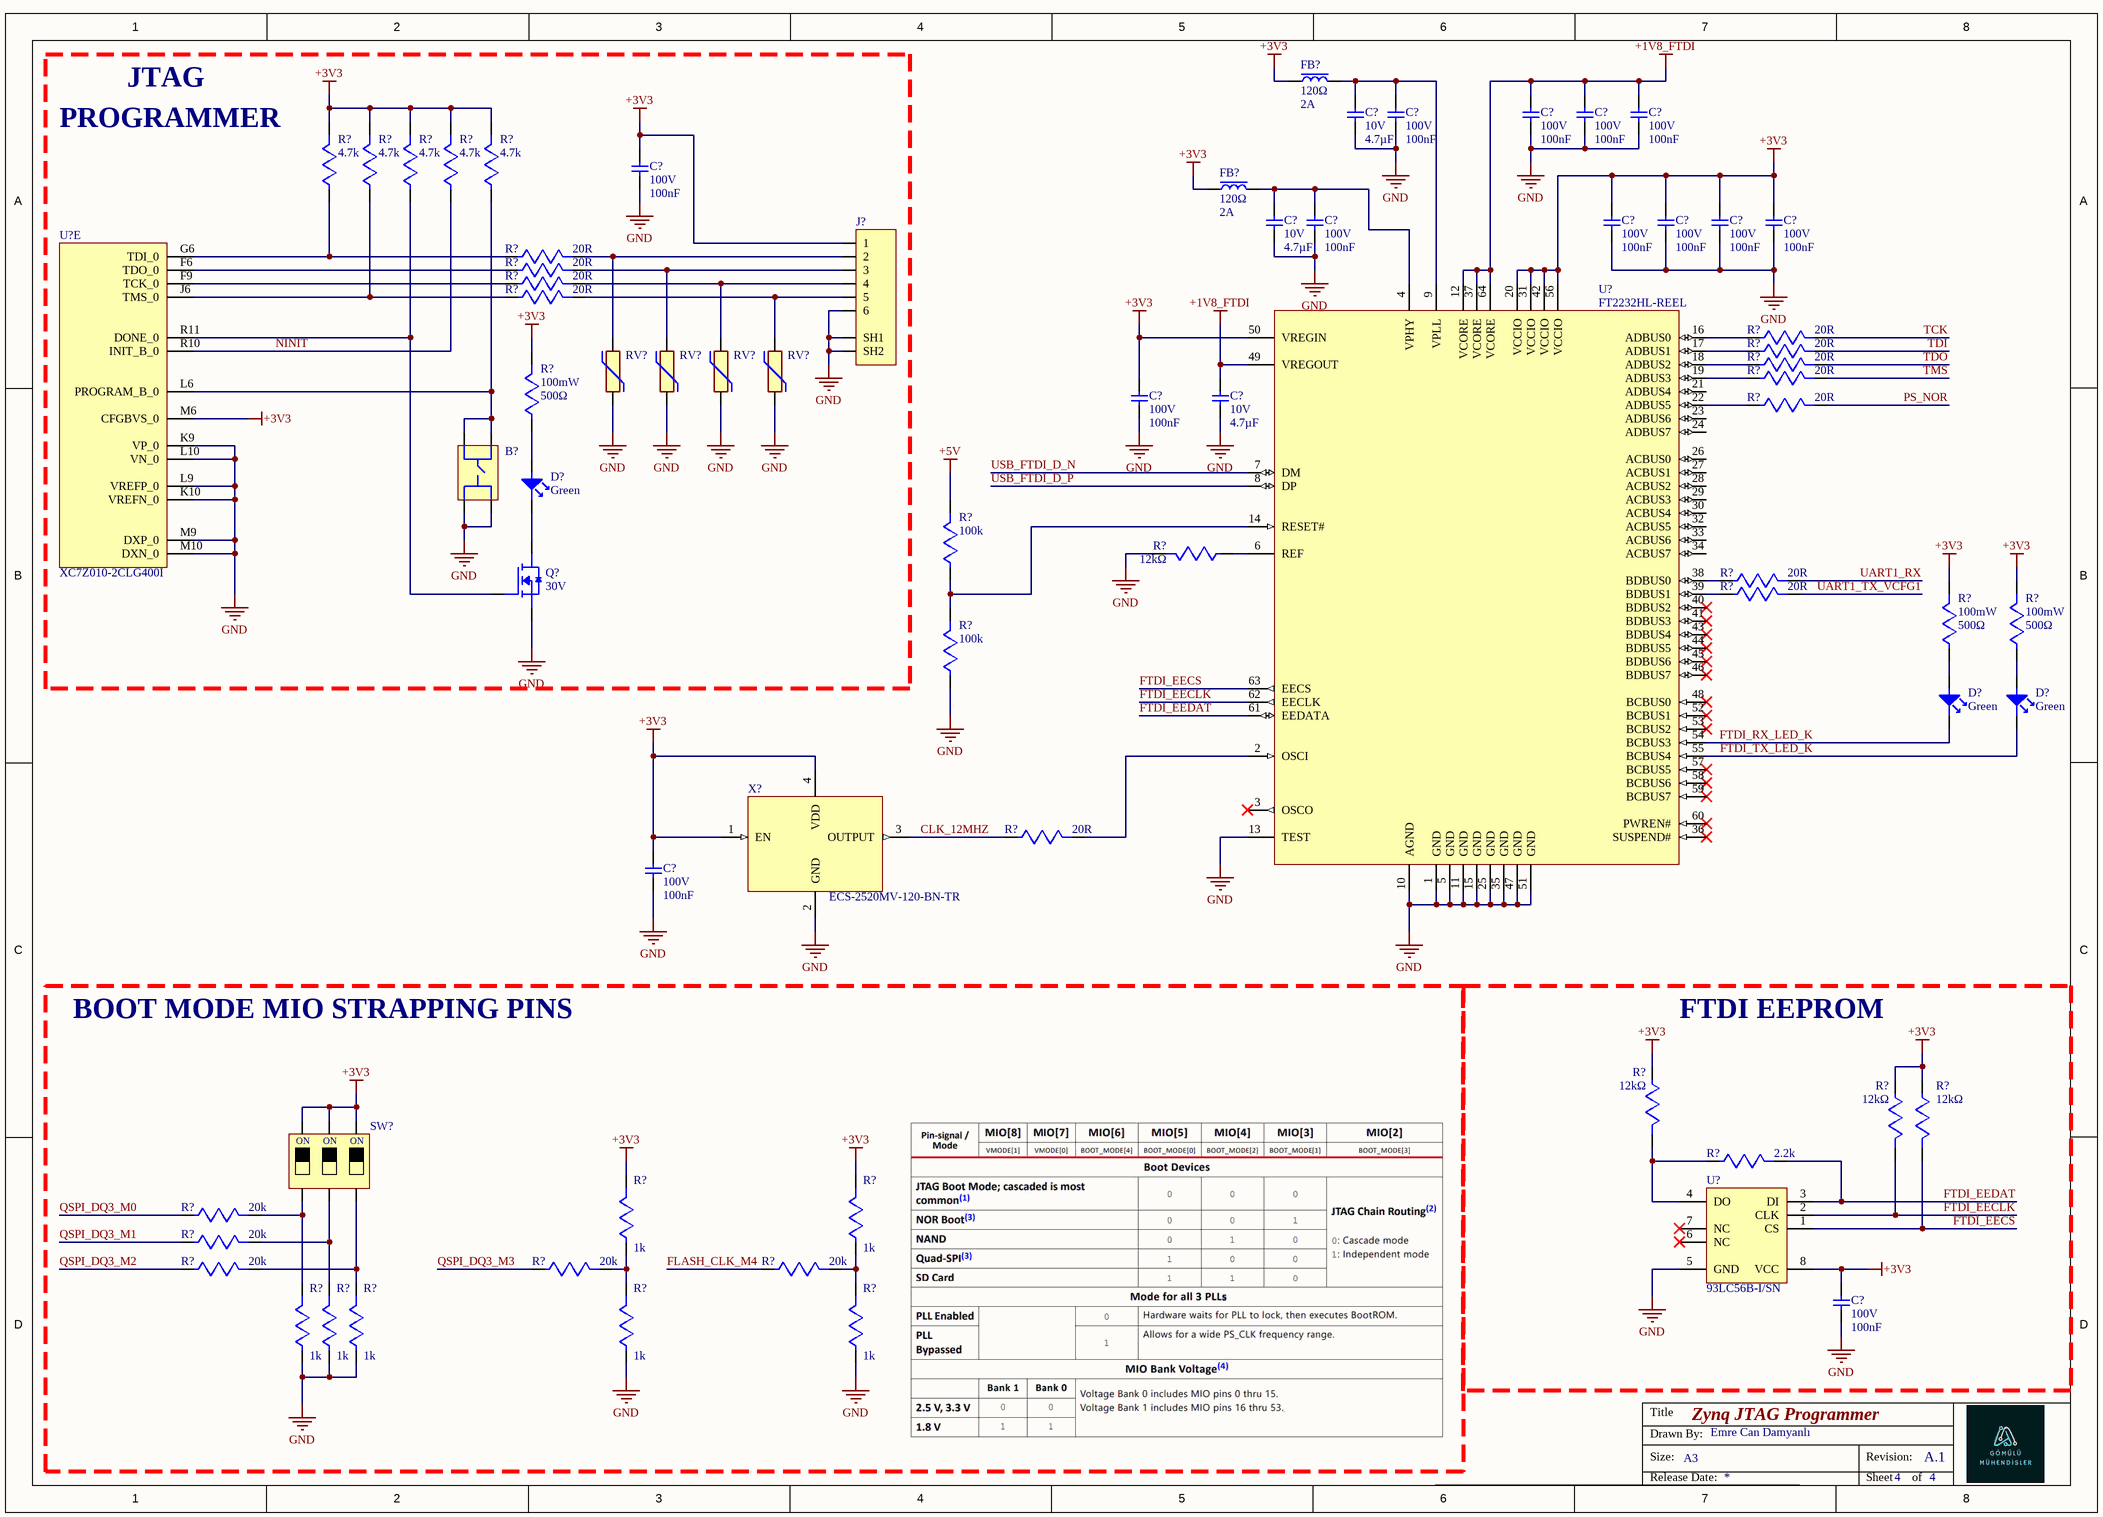
[diagram p3: Zynq_JTAG_Programmer.SchDoc]

### Parts
(Parts that share a designator on the sheet are numbered #1, #2 ... from top to bottom, then left to right.)
B?#1  GSPTS0020  [SW4_PTS815 SJM 250 SMTR LFS_CNK]  (value not drawn)
C?#100  value 100nF  Voltage Rating: 100V  [CAPC1608X94N]  (hidden comment: GCJ188R72A104KA01D)
C?#101  value 100nF  Voltage Rating: 100V  [CAPC1608X94N]  (hidden comment: GCJ188R72A104KA01D)
C?#102  value 100nF  Voltage Rating: 100V  [CAPC1608X94N]  (hidden comment: GCJ188R72A104KA01D)
C?#103  value 100nF  Voltage Rating: 100V  [CAPC1608X94N]  (hidden comment: GCJ188R72A104KA01D)
C?#104  value 4.7µF  Voltage Rating: 10V  [CAPC1005X55N]  (hidden comment: CL05A475MP5NRNC)
C?#105  value 100nF  Voltage Rating: 100V  [CAPC1608X94N]  (hidden comment: GCJ188R72A104KA01D)
C?#106  value 100nF  Voltage Rating: 100V  [CAPC1608X94N]  (hidden comment: GCJ188R72A104KA01D)
C?#107  value 100nF  Voltage Rating: 100V  [CAPC1608X94N]  (hidden comment: GCJ188R72A104KA01D)
C?#108  value 100nF  Voltage Rating: 100V  [CAPC1608X94N]  (hidden comment: GCJ188R72A104KA01D)
C?#109  value 100nF  Voltage Rating: 100V  [CAPC1608X94N]  (hidden comment: GCJ188R72A104KA01D)
C?#110  value 100nF  Voltage Rating: 100V  [CAPC1608X94N]  (hidden comment: GCJ188R72A104KA01D)
C?#111  value 4.7µF  Voltage Rating: 10V  [CAPC1005X55N]  (hidden comment: CL05A475MP5NRNC)
C?#112  value 100nF  Voltage Rating: 100V  [CAPC1608X94N]  (hidden comment: GCJ188R72A104KA01D)
C?#113  value 4.7µF  Voltage Rating: 10V  [CAPC1005X55N]  (hidden comment: CL05A475MP5NRNC)
C?#114  value 100nF  Voltage Rating: 100V  [CAPC1608X94N]  (hidden comment: GCJ188R72A104KA01D)
C?#115  value 100nF  Voltage Rating: 100V  [CAPC1608X94N]  (hidden comment: GCJ188R72A104KA01D)
D?#4  Color: Green  [LED_0603_GREEN]  (hidden comment: LTST-C191KGKT)
D?#5  Color: Green  [LED_0603_GREEN]  (hidden comment: LTST-C191KGKT)
D?#6  Color: Green  [LED_0603_GREEN]  (hidden comment: LTST-C191KGKT)
FB?#3  Impedance: 120Ω  Max Current Rating: 2A  [FERRITE_0402]  (hidden comment: BLM15PX121SN1D)
FB?#4  Impedance: 120Ω  Max Current Rating: 2A  [FERRITE_0402]  (hidden comment: BLM15PX121SN1D)
J?#2  S6B-ZR-SM4A-TF  [JST_S6B-ZR-SM4A-TF(LF)(SN)]  (value not drawn)
Q?#5  Drain to Source Voltage (Vdss): 30V  [CDSOT23]  (hidden comment: DMG3402L-7)
R?#35  value 4.7k  [RESISTOR_0603]  (hidden comment: RC0603FR-074K7L)
R?#36  value 4.7k  [RESISTOR_0603]  (hidden comment: RC0603FR-074K7L)
R?#37  value 4.7k  [RESISTOR_0603]  (hidden comment: RC0603FR-074K7L)
R?#38  value 4.7k  [RESISTOR_0603]  (hidden comment: RC0603FR-074K7L)
R?#39  value 4.7k  [RESISTOR_0603]  (hidden comment: RC0603FR-074K7L)
R?#40  value 20R  (hidden comment: RC0603FR-0720RL)
R?#41  value 20R  (hidden comment: RC0603FR-0720RL)
R?#42  value 20R  (hidden comment: RC0603FR-0720RL)
R?#43  value 20R  (hidden comment: RC0603FR-0720RL)
R?#44  value 20R  (hidden comment: RC0603FR-0720RL)
R?#45  value 20R  (hidden comment: RC0603FR-0720RL)
R?#46  value 20R  (hidden comment: RC0603FR-0720RL)
R?#47  value 20R  (hidden comment: RC0603FR-0720RL)
R?#48  value 500Ω  Power Rating: 100mW  [RESISTOR_0603]  (hidden comment: RT0603BRC07500RL)
R?#49  value 20R  (hidden comment: RC0603FR-0720RL)
R?#50  value 100k  [RESISTOR_0603]  (hidden comment: RC0603FR-07100KL)
R?#51  value 12kΩ  [RESISTOR_0603]  (hidden comment: RC0603FR-0712KL)
R?#52  value 20R  (hidden comment: RC0603FR-0720RL)
R?#53  value 20R  (hidden comment: RC0603FR-0720RL)
R?#54  value 500Ω  Power Rating: 100mW  [RESISTOR_0603]  (hidden comment: RT0603BRC07500RL)
R?#55  value 500Ω  Power Rating: 100mW  [RESISTOR_0603]  (hidden comment: RT0603BRC07500RL)
R?#56  value 100k  [RESISTOR_0603]  (hidden comment: RC0603FR-07100KL)
R?#57  value 20R  (hidden comment: RC0603FR-0720RL)
R?#58  value 12kΩ  [RESISTOR_0603]  (hidden comment: RC0603FR-0712KL)
R?#59  value 12kΩ  [RESISTOR_0603]  (hidden comment: RC0603FR-0712KL)
R?#60  value 12kΩ  [RESISTOR_0603]  (hidden comment: RC0603FR-0712KL)
R?#61  value 2.2k  [RESISTOR_0603]  (hidden comment: RC0603FR-072K2L)
R?#62  value 20k  [RESISTOR_0603]  (hidden comment: RC0603FR-0720KL)
R?#63  value 1k  [RESISTOR_0603]  (hidden comment: RC0603FR-071KL)
R?#64  value 1k  [RESISTOR_0603]  (hidden comment: RC0603FR-071KL)
R?#65  value 20k  [RESISTOR_0603]  (hidden comment: RC0603FR-0720KL)
R?#66  value 20k  [RESISTOR_0603]  (hidden comment: RC0603FR-0720KL)
R?#67  value 20k  [RESISTOR_0603]  (hidden comment: RC0603FR-0720KL)
R?#68  value 20k  [RESISTOR_0603]  (hidden comment: RC0603FR-0720KL)
R?#69  value 1k  [RESISTOR_0603]  (hidden comment: RC0603FR-071KL)
R?#70  value 1k  [RESISTOR_0603]  (hidden comment: RC0603FR-071KL)
R?#71  value 1k  [RESISTOR_0603]  (hidden comment: RC0603FR-071KL)
R?#72  value 1k  [RESISTOR_0603]  (hidden comment: RC0603FR-071KL)
R?#73  value 1k  [RESISTOR_0603]  (hidden comment: RC0603FR-071KL)
RV?#1  CG0402MLU-3.3G  [VARC1005X41N]  (value not drawn)
RV?#2  CG0402MLU-3.3G  [VARC1005X41N]  (value not drawn)
RV?#3  CG0402MLU-3.3G  [VARC1005X41N]  (value not drawn)
RV?#4  CG0402MLU-3.3G  [VARC1005X41N]  (value not drawn)
SW?  219-3LPST  [2193LPST]  (value not drawn)
U?#11  XC7Z010-2CLG400I  [BGA400C80P20X20_1700X1700X160]  (part E of 9)
U?#12  FT2232HL-REEL  [LQFP-64-0.5mm]
U?#13  93LC56B-I/SN  [SOIC127P599X175-8N]
X?#1  ECS-2520MV-120-BN-TR  [OSCCC250X200X90N]

### Nets
+1V8_FTDI: C?#101.2 C?#102.2 C?#103.2 C?#113.2 U?#12.12(VCORE) U?#12.37(VCORE) U?#12.49(VREGOUT) U?#12.64(VCORE)
+3V3: C?#105.2 C?#107.2 C?#108.2 C?#109.2 C?#110.2 C?#112.2 C?#114.2 C?#115.2 FB?#3.1 FB?#4.1 J?#2.1 R?#35.2 R?#36.2 R?#37.2 R?#38.2 R?#39.2 R?#48.2 R?#54.2 R?#55.2 R?#58.1 R?#59.1 R?#60.1 R?#63.2 R?#64.2 SW?.4 SW?.5 SW?.6 U?#11.M6(CFGBVS_0) U?#12.20(VCCIO) U?#12.31(VCCIO) U?#12.42(VCCIO) U?#12.50(VREGIN) U?#12.56(VCCIO) U?#13.8(VCC) X?#1.1(EN) X?#1.4(VDD)
+5V: R?#50.2
GND: B?#1.3 B?#1.4 C?#100.1 C?#101.1 C?#102.1 C?#103.1 C?#104.1 C?#105.1 C?#106.1 C?#107.1 C?#108.1 C?#109.1 C?#110.1 C?#111.1 C?#112.1 C?#113.1 C?#114.1 C?#115.1 J?#2.6 J?#2.SH1 J?#2.SH2 Q?#5.2(S) R?#51.2 R?#56.1 R?#69.1 R?#70.1 R?#71.1 R?#72.1 R?#73.1 RV?#1.1 RV?#2.1 RV?#3.1 RV?#4.1 U?#11.K9(VP_0) U?#11.K10(VREFN_0) U?#11.L9(VREFP_0) U?#11.L10(VN_0) U?#11.M9(DXP_0) U?#11.M10(DXN_0) U?#12.1(GND) U?#12.5(GND) U?#12.10(AGND) U?#12.11(GND) U?#12.13(TEST) U?#12.15(GND) U?#12.25(GND) U?#12.35(GND) U?#12.47(GND) U?#12.51(GND) U?#13.5(GND) X?#1.2(GND)
CLK_12MHZ: R?#57.1 X?#1.3(OUTPUT)
FLASH_CLK_M4: R?#68.1
FTDI_EECLK: R?#59.2 U?#12.62(EECLK) U?#13.2(CLK)
FTDI_EECS: R?#60.2 U?#12.63(EECS) U?#13.1(CS)
FTDI_EEDAT: R?#61.2 U?#12.61(EEDATA) U?#13.3(DI)
FTDI_RX_LED_K: D?#5.2 U?#12.54(BCBUS3)
FTDI_TX_LED_K: D?#6.2 U?#12.55(BCBUS4)
NINIT: R?#38.1 U?#11.R10(INIT_B_0)
PS_NOR: R?#49.2
QSPI_DQ3_M0: R?#62.1
QSPI_DQ3_M1: R?#65.1
QSPI_DQ3_M2: R?#66.1
QSPI_DQ3_M3: R?#67.1
TCK: R?#44.2
TDI: R?#45.2
TDO: R?#46.2
TMS: R?#47.2
UART1_RX: R?#52.2
UART1_TX_VCFG1: R?#53.2
USB_FTDI_D_N: U?#12.7(DM)
USB_FTDI_D_P: U?#12.8(DP)
NetB?#1_1: B?#1.1 B?#1.2 R?#39.1 U?#11.L6(PROGRAM_B_0)
NetC?#100_2: C?#100.2 C?#104.2 FB?#3.2 U?#12.9(VPLL)
NetC?#106_2: C?#106.2 C?#111.2 FB?#4.2 U?#12.4(VPHY)
NetD?#4_1: D?#4.1 R?#48.1
NetD?#4_2: D?#4.2 Q?#5.3(D)
NetD?#5_1: D?#5.1 R?#54.1
NetD?#6_1: D?#6.1 R?#55.1
NetJ?#2_2: J?#2.2 R?#40.2 RV?#1.2
NetJ?#2_3: J?#2.3 R?#41.2 RV?#2.2
NetJ?#2_4: J?#2.4 R?#42.2 RV?#3.2
NetJ?#2_5: J?#2.5 R?#43.2 RV?#4.2
NetQ?#5_1: Q?#5.1(G) R?#37.1 U?#11.R11(DONE_0)
NetR?#35_1: R?#35.1 R?#40.1 U?#11.G6(TDI_0)
NetR?#36_1: R?#36.1 R?#43.1 U?#11.J6(TMS_0)
NetR?#41_1: R?#41.1 U?#11.F6(TDO_0)
NetR?#42_1: R?#42.1 U?#11.F9(TCK_0)
NetR?#44_1: R?#44.1 U?#12.16(ADBUS0)
NetR?#45_1: R?#45.1 U?#12.17(ADBUS1)
NetR?#46_1: R?#46.1 U?#12.18(ADBUS2)
NetR?#47_1: R?#47.1 U?#12.19(ADBUS3)
NetR?#49_1: R?#49.1 U?#12.22(ADBUS5)
NetR?#50_1: R?#50.1 R?#56.2 U?#12.14(RESET#)
NetR?#51_1: R?#51.1 U?#12.6(REF)
NetR?#52_1: R?#52.1 U?#12.38(BDBUS0)
NetR?#53_1: R?#53.1 U?#12.39(BDBUS1)
NetR?#57_2: R?#57.2 U?#12.2(OSCI)
NetR?#58_2: R?#58.2 R?#61.1 U?#13.4(DO)
NetR?#62_2: R?#62.2 R?#69.2 SW?.1
NetR?#63_1: R?#63.1 R?#67.2 R?#72.2
NetR?#64_1: R?#64.1 R?#68.2 R?#73.2
NetR?#65_2: R?#65.2 R?#70.2 SW?.2
NetR?#66_2: R?#66.2 R?#71.2 SW?.3

Not connected (* = marked no-connect by the designer): U?#12 3(OSCO)* 21(ADBUS4) 23(ADBUS6) 24(ADBUS7) 26(ACBUS0) 27(ACBUS1) 28(ACBUS2) 29(ACBUS3) 30(ACBUS4) 32(ACBUS5) 33(ACBUS6) 34(ACBUS7) 36(SUSPEND#)* 40(BDBUS2)* 41(BDBUS3)* 43(BDBUS4)* 44(BDBUS5)* 45(BDBUS6)* 46(BDBUS7)* 48(BCBUS0)* 52(BCBUS1)* 53(BCBUS2)* 57(BCBUS5)* 58(BCBUS6)* 59(BCBUS7)* 60(PWREN#)*; U?#13 6(NC)* 7(NC)*

### Notes on the sheet
- JTAG
- PROGRAMMER
- BOOT MODE MIO STRAPPING PINS
- FTDI EEPROM
- Title
- Size:
- Drawn By:
- A3
- Revision:
- Release Date:
- Sheet
- of
- (in symbol 219-3LPST) ON